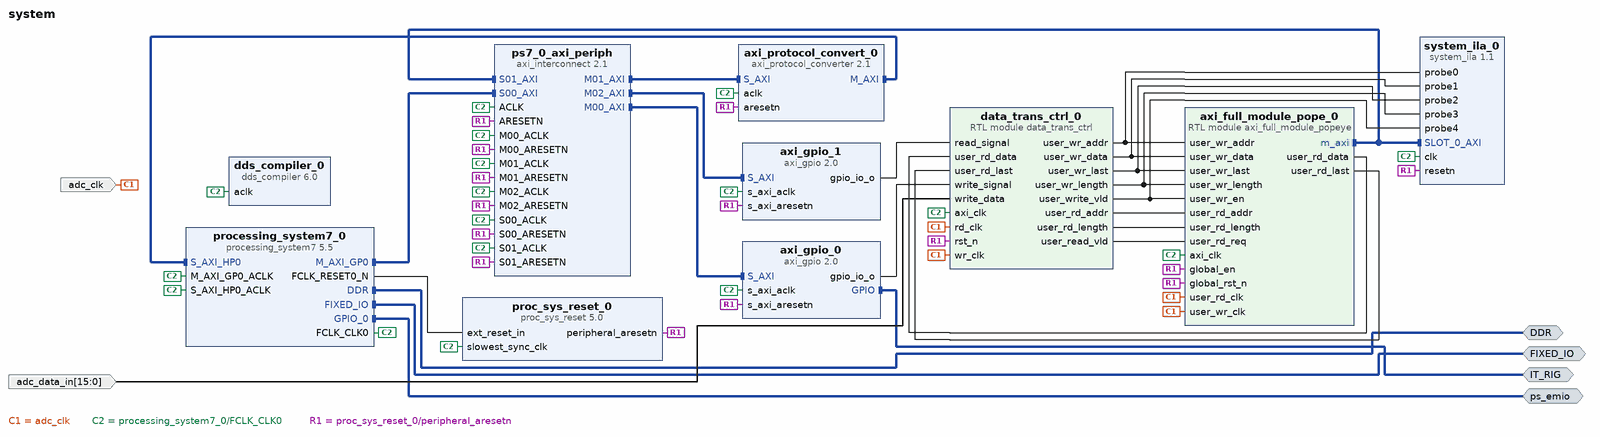
[diagram p0: block diagram of the top level]
# Vivado block design system, xc7z015clg485-2, Vivado 2023.1
create_bd_design system

create_bd_intf_port -mode Master -vlnv xilinx.com:interface:ddrx_rtl:1.0 DDR
create_bd_intf_port -mode Master -vlnv xilinx.com:display_processing_system7:fixedio_rtl:1.0 FIXED_IO
create_bd_intf_port -mode Master -vlnv xilinx.com:interface:gpio_rtl:1.0 ps_emio
create_bd_intf_port -mode Master -vlnv xilinx.com:interface:gpio_rtl:1.0 IT_RIG
create_bd_port -dir I -from 15 -to 0 adc_data_in
create_bd_port -dir I -type clk adc_clk
set_property -dict {CONFIG.FREQ_HZ 200000000} [get_bd_ports adc_clk]

create_bd_cell -type ip -vlnv xilinx.com:ip:processing_system7:5.5 processing_system7_0
set_property -dict [list \
  CONFIG.PCW_APU_PERIPHERAL_FREQMHZ 666.666666 \
  CONFIG.PCW_CPU_CPU_6X4X_MAX_RANGE 767 \
  CONFIG.PCW_ENET0_ENET0_IO {MIO 16 .. 27} \
  CONFIG.PCW_ENET0_GRP_MDIO_ENABLE 1 \
  CONFIG.PCW_ENET0_GRP_MDIO_IO {MIO 52 .. 53} \
  CONFIG.PCW_ENET0_PERIPHERAL_ENABLE 1 \
  CONFIG.PCW_ENET0_RESET_ENABLE 0 \
  CONFIG.PCW_ENET_RESET_ENABLE 1 \
  CONFIG.PCW_ENET_RESET_SELECT {Share reset pin} \
  CONFIG.PCW_FCLK_CLK0_BUF FALSE \
  CONFIG.PCW_FPGA0_PERIPHERAL_FREQMHZ 200 \
  CONFIG.PCW_FPGA1_PERIPHERAL_FREQMHZ 100 \
  CONFIG.PCW_GPIO_EMIO_GPIO_ENABLE 1 \
  CONFIG.PCW_GPIO_EMIO_GPIO_IO 4 \
  CONFIG.PCW_GPIO_EMIO_GPIO_WIDTH 4 \
  CONFIG.PCW_GPIO_MIO_GPIO_ENABLE 1 \
  CONFIG.PCW_GPIO_MIO_GPIO_IO MIO \
  CONFIG.PCW_I2C_RESET_ENABLE 0 \
  CONFIG.PCW_PERIPHERAL_BOARD_PRESET None \
  CONFIG.PCW_PRESET_BANK1_VOLTAGE {LVCMOS 1.8V} \
  CONFIG.PCW_QSPI_GRP_FBCLK_ENABLE 1 \
  CONFIG.PCW_QSPI_GRP_FBCLK_IO {MIO 8} \
  CONFIG.PCW_QSPI_GRP_SINGLE_SS_ENABLE 1 \
  CONFIG.PCW_QSPI_GRP_SINGLE_SS_IO {MIO 1 .. 6} \
  CONFIG.PCW_QSPI_PERIPHERAL_ENABLE 1 \
  CONFIG.PCW_QSPI_PERIPHERAL_FREQMHZ 125 \
  CONFIG.PCW_QSPI_QSPI_IO {MIO 1 .. 6} \
  CONFIG.PCW_SD0_GRP_CD_ENABLE 1 \
  CONFIG.PCW_SD0_GRP_CD_IO {MIO 47} \
  CONFIG.PCW_SD0_GRP_WP_ENABLE 0 \
  CONFIG.PCW_SD0_PERIPHERAL_ENABLE 1 \
  CONFIG.PCW_SD0_SD0_IO {MIO 40 .. 45} \
  CONFIG.PCW_SD1_GRP_CD_ENABLE 1 \
  CONFIG.PCW_SD1_GRP_CD_IO {MIO 9} \
  CONFIG.PCW_SD1_PERIPHERAL_ENABLE 1 \
  CONFIG.PCW_SD1_SD1_IO {MIO 10 .. 15} \
  CONFIG.PCW_SDIO_PERIPHERAL_FREQMHZ 50 \
  CONFIG.PCW_SINGLE_QSPI_DATA_MODE x4 \
  CONFIG.PCW_UART1_PERIPHERAL_ENABLE 1 \
  CONFIG.PCW_UART1_UART1_IO {MIO 28 .. 29} \
  CONFIG.PCW_UART_PERIPHERAL_FREQMHZ 100 \
  CONFIG.PCW_UIPARAM_DDR_FREQ_MHZ 533.333333 \
  CONFIG.PCW_UIPARAM_DDR_MEMORY_TYPE {DDR 3 (Low Voltage)} \
  CONFIG.PCW_UIPARAM_DDR_PARTNO {MT41K256M16 RE-125} \
  CONFIG.PCW_USB0_PERIPHERAL_ENABLE 0 \
  CONFIG.PCW_USB_RESET_ENABLE 0 \
  CONFIG.PCW_USE_S_AXI_HP0 1 \
  CONFIG.preset None \
] [get_bd_cells processing_system7_0]
# 501 more settings of processing_system7_0 are not shown: defaults, MIO pin electricals, DDR timing, and values the tool derives
create_bd_cell -type module -reference data_trans_ctrl data_trans_ctrl_0
set_property -dict [list \
  CONFIG.RD_BASEADDR 0x00000000 \
  CONFIG.SINGLE_RD_LENGTH 128 \
  CONFIG.SINGLE_WR_LENGTH 128 \
  CONFIG.TOTAL_RD_LENGTH 409600 \
  CONFIG.TOTAL_WR_LENGTH 409600 \
  CONFIG.WR_BASEADDR 0x00000000 \
] [get_bd_cells data_trans_ctrl_0]
create_bd_cell -type ip -vlnv xilinx.com:ip:axi_protocol_converter:2.1 axi_protocol_convert_0
set_property -dict [list \
  CONFIG.MI_PROTOCOL AXI3 \
  CONFIG.SI_PROTOCOL AXI4 \
  CONFIG.TRANSLATION_MODE 2 \
] [get_bd_cells axi_protocol_convert_0]
create_bd_cell -type ip -vlnv xilinx.com:ip:axi_gpio:2.0 axi_gpio_0
set_property -dict {CONFIG.C_ALL_OUTPUTS 1 CONFIG.C_GPIO_WIDTH 1} [get_bd_cells axi_gpio_0]
create_bd_cell -type ip -vlnv xilinx.com:ip:axi_interconnect:2.1 ps7_0_axi_periph
set_property -dict [list \
  CONFIG.M00_HAS_DATA_FIFO 0 \
  CONFIG.M00_HAS_REGSLICE 0 \
  CONFIG.M01_HAS_DATA_FIFO 0 \
  CONFIG.M01_HAS_REGSLICE 0 \
  CONFIG.NUM_MI 3 \
  CONFIG.NUM_SI 2 \
  CONFIG.S00_HAS_DATA_FIFO 2 \
  CONFIG.S00_HAS_REGSLICE 3 \
  CONFIG.S01_HAS_DATA_FIFO 2 \
  CONFIG.S01_HAS_REGSLICE 3 \
] [get_bd_cells ps7_0_axi_periph]
create_bd_cell -type module -reference axi_full_module_popeye axi_full_module_pope_0
set_property -dict {CONFIG.AXI_DATA_WIDTH 64} [get_bd_cells axi_full_module_pope_0]
create_bd_cell -type ip -vlnv xilinx.com:ip:dds_compiler:6.0 dds_compiler_0
set_property -dict [list \
  CONFIG.DDS_Clock_Rate 200 \
  CONFIG.Frequency_Resolution 0.4 \
  CONFIG.Has_Phase_Out false \
  CONFIG.M_DATA_Has_TUSER Not_Required \
  CONFIG.Noise_Shaping Auto \
  CONFIG.Output_Frequency1 10 \
  CONFIG.Output_Width 8 \
  CONFIG.PINC1 1100110011001100110011001 \
  CONFIG.Phase_Width 29 \
] [get_bd_cells dds_compiler_0]
create_bd_cell -type ip -vlnv xilinx.com:ip:axi_gpio:2.0 axi_gpio_1
set_property -dict {CONFIG.C_ALL_OUTPUTS 1 CONFIG.C_GPIO_WIDTH 1} [get_bd_cells axi_gpio_1]
create_bd_cell -type ip -vlnv xilinx.com:ip:proc_sys_reset:5.0 proc_sys_reset_0
create_bd_cell -type ip -vlnv xilinx.com:ip:system_ila:1.1 system_ila_0
set_property -dict [list \
  CONFIG.C_MON_TYPE MIX \
  CONFIG.C_NUM_MONITOR_SLOTS 1 \
  CONFIG.C_NUM_OF_PROBES 5 \
  CONFIG.C_PROBE0_TYPE 0 \
  CONFIG.C_PROBE1_TYPE 0 \
  CONFIG.C_PROBE2_TYPE 0 \
  CONFIG.C_PROBE3_TYPE 0 \
  CONFIG.C_PROBE4_TYPE 0 \
  CONFIG.C_SLOT_0_APC_EN 0 \
  CONFIG.C_SLOT_0_AXI_AR_SEL_DATA 1 \
  CONFIG.C_SLOT_0_AXI_AR_SEL_TRIG 1 \
  CONFIG.C_SLOT_0_AXI_AW_SEL_DATA 1 \
  CONFIG.C_SLOT_0_AXI_AW_SEL_TRIG 1 \
  CONFIG.C_SLOT_0_AXI_B_SEL_DATA 1 \
  CONFIG.C_SLOT_0_AXI_B_SEL_TRIG 1 \
  CONFIG.C_SLOT_0_AXI_R_SEL_DATA 1 \
  CONFIG.C_SLOT_0_AXI_R_SEL_TRIG 1 \
  CONFIG.C_SLOT_0_AXI_W_SEL_DATA 1 \
  CONFIG.C_SLOT_0_AXI_W_SEL_TRIG 1 \
  CONFIG.C_SLOT_0_INTF_TYPE xilinx.com:interface:aximm_rtl:1.0 \
] [get_bd_cells system_ila_0]

# ---- connections ----

connect_bd_intf_net -intf_net axi_full_module_pope_0_m_axi [get_bd_intf_pins axi_full_module_pope_0/m_axi] [get_bd_intf_pins ps7_0_axi_periph/S01_AXI]
connect_bd_intf_net [get_bd_intf_pins axi_full_module_pope_0/m_axi] [get_bd_intf_pins system_ila_0/SLOT_0_AXI]
connect_bd_intf_net [get_bd_intf_ports IT_RIG] [get_bd_intf_pins axi_gpio_0/GPIO]
connect_bd_intf_net [get_bd_intf_pins axi_protocol_convert_0/M_AXI] [get_bd_intf_pins processing_system7_0/S_AXI_HP0]
connect_bd_intf_net [get_bd_intf_ports DDR] [get_bd_intf_pins processing_system7_0/DDR]
connect_bd_intf_net [get_bd_intf_ports FIXED_IO] [get_bd_intf_pins processing_system7_0/FIXED_IO]
connect_bd_intf_net [get_bd_intf_ports ps_emio] [get_bd_intf_pins processing_system7_0/GPIO_0]
connect_bd_intf_net [get_bd_intf_pins processing_system7_0/M_AXI_GP0] [get_bd_intf_pins ps7_0_axi_periph/S00_AXI]
connect_bd_intf_net [get_bd_intf_pins ps7_0_axi_periph/M00_AXI] [get_bd_intf_pins axi_gpio_0/S_AXI]
connect_bd_intf_net [get_bd_intf_pins ps7_0_axi_periph/M01_AXI] [get_bd_intf_pins axi_protocol_convert_0/S_AXI]
connect_bd_intf_net [get_bd_intf_pins axi_gpio_1/S_AXI] [get_bd_intf_pins ps7_0_axi_periph/M02_AXI]
connect_bd_net [get_bd_ports adc_clk] \
  [get_bd_pins axi_full_module_pope_0/user_wr_clk] [get_bd_pins axi_full_module_pope_0/user_rd_clk] \
  [get_bd_pins data_trans_ctrl_0/rd_clk] [get_bd_pins data_trans_ctrl_0/wr_clk]
connect_bd_net [get_bd_pins processing_system7_0/FCLK_CLK0] \
  [get_bd_pins axi_protocol_convert_0/aclk] [get_bd_pins axi_gpio_1/s_axi_aclk] \
  [get_bd_pins processing_system7_0/M_AXI_GP0_ACLK] [get_bd_pins processing_system7_0/S_AXI_HP0_ACLK] \
  [get_bd_pins proc_sys_reset_0/slowest_sync_clk] [get_bd_pins axi_gpio_0/s_axi_aclk] [get_bd_pins ps7_0_axi_periph/ACLK] \
  [get_bd_pins ps7_0_axi_periph/S00_ACLK] [get_bd_pins ps7_0_axi_periph/M00_ACLK] [get_bd_pins ps7_0_axi_periph/S01_ACLK] \
  [get_bd_pins ps7_0_axi_periph/M01_ACLK] [get_bd_pins ps7_0_axi_periph/M02_ACLK] \
  [get_bd_pins axi_full_module_pope_0/axi_clk] [get_bd_pins data_trans_ctrl_0/axi_clk] [get_bd_pins dds_compiler_0/aclk] \
  [get_bd_pins system_ila_0/clk]
connect_bd_net [get_bd_ports adc_data_in] [get_bd_pins data_trans_ctrl_0/write_data]
connect_bd_net [get_bd_pins axi_full_module_pope_0/user_rd_data] [get_bd_pins data_trans_ctrl_0/user_rd_data]
connect_bd_net [get_bd_pins axi_full_module_pope_0/user_rd_last] [get_bd_pins data_trans_ctrl_0/user_rd_last]
connect_bd_net [get_bd_pins axi_gpio_0/gpio_io_o] [get_bd_pins data_trans_ctrl_0/write_signal]
connect_bd_net [get_bd_pins axi_gpio_1/gpio_io_o] [get_bd_pins data_trans_ctrl_0/read_signal]
connect_bd_net [get_bd_pins data_trans_ctrl_0/user_rd_addr] [get_bd_pins axi_full_module_pope_0/user_rd_addr]
connect_bd_net [get_bd_pins data_trans_ctrl_0/user_rd_length] [get_bd_pins axi_full_module_pope_0/user_rd_length]
connect_bd_net [get_bd_pins data_trans_ctrl_0/user_read_vld] [get_bd_pins axi_full_module_pope_0/user_rd_req]
connect_bd_net -net data_trans_ctrl_0_user_wr_addr [get_bd_pins data_trans_ctrl_0/user_wr_addr] \
  [get_bd_pins axi_full_module_pope_0/user_wr_addr] [get_bd_pins system_ila_0/probe0]
connect_bd_net -net data_trans_ctrl_0_user_wr_data [get_bd_pins data_trans_ctrl_0/user_wr_data] \
  [get_bd_pins axi_full_module_pope_0/user_wr_data] [get_bd_pins system_ila_0/probe1]
connect_bd_net -net data_trans_ctrl_0_user_wr_last [get_bd_pins data_trans_ctrl_0/user_wr_last] \
  [get_bd_pins axi_full_module_pope_0/user_wr_last] [get_bd_pins system_ila_0/probe2]
connect_bd_net -net data_trans_ctrl_0_user_wr_length [get_bd_pins data_trans_ctrl_0/user_wr_length] \
  [get_bd_pins axi_full_module_pope_0/user_wr_length] [get_bd_pins system_ila_0/probe3]
connect_bd_net -net data_trans_ctrl_0_user_write_vld [get_bd_pins data_trans_ctrl_0/user_write_vld] \
  [get_bd_pins axi_full_module_pope_0/user_wr_en] [get_bd_pins system_ila_0/probe4]
connect_bd_net [get_bd_pins proc_sys_reset_0/peripheral_aresetn] \
  [get_bd_pins axi_gpio_0/s_axi_aresetn] [get_bd_pins axi_protocol_convert_0/aresetn] [get_bd_pins axi_gpio_1/s_axi_aresetn] \
  [get_bd_pins ps7_0_axi_periph/M02_ARESETN] [get_bd_pins ps7_0_axi_periph/M01_ARESETN] \
  [get_bd_pins ps7_0_axi_periph/S01_ARESETN] [get_bd_pins ps7_0_axi_periph/M00_ARESETN] \
  [get_bd_pins ps7_0_axi_periph/S00_ARESETN] [get_bd_pins ps7_0_axi_periph/ARESETN] [get_bd_pins system_ila_0/resetn] \
  [get_bd_pins axi_full_module_pope_0/global_rst_n] [get_bd_pins axi_full_module_pope_0/global_en] \
  [get_bd_pins data_trans_ctrl_0/rst_n]
connect_bd_net [get_bd_pins processing_system7_0/FCLK_RESET0_N] [get_bd_pins proc_sys_reset_0/ext_reset_in]
set_property HDL_ATTRIBUTE.DEBUG true [get_bd_intf_nets axi_full_module_pope_0_m_axi]
set_property HDL_ATTRIBUTE.MARK_DEBUG true [get_bd_intf_nets axi_full_module_pope_0_m_axi]
set_property HDL_ATTRIBUTE.DEBUG true [get_bd_nets data_trans_ctrl_0_user_wr_addr]
set_property HDL_ATTRIBUTE.MARK_DEBUG true [get_bd_nets data_trans_ctrl_0_user_wr_addr]
set_property HDL_ATTRIBUTE.DEBUG true [get_bd_nets data_trans_ctrl_0_user_wr_data]
set_property HDL_ATTRIBUTE.MARK_DEBUG true [get_bd_nets data_trans_ctrl_0_user_wr_data]
set_property HDL_ATTRIBUTE.DEBUG true [get_bd_nets data_trans_ctrl_0_user_wr_last]
set_property HDL_ATTRIBUTE.MARK_DEBUG true [get_bd_nets data_trans_ctrl_0_user_wr_last]
set_property HDL_ATTRIBUTE.DEBUG true [get_bd_nets data_trans_ctrl_0_user_wr_length]
set_property HDL_ATTRIBUTE.MARK_DEBUG true [get_bd_nets data_trans_ctrl_0_user_wr_length]
set_property HDL_ATTRIBUTE.DEBUG true [get_bd_nets data_trans_ctrl_0_user_write_vld]
set_property HDL_ATTRIBUTE.MARK_DEBUG true [get_bd_nets data_trans_ctrl_0_user_write_vld]

# ---- address map ----
assign_bd_address -offset 0x00000000 -range 1G -target_address_space [get_bd_addr_spaces axi_full_module_pope_0/m_axi] [get_bd_addr_segs processing_system7_0/S_AXI_HP0/HP0_DDR_LOWOCM]
assign_bd_address -offset 0x41200000 -range 64K -target_address_space [get_bd_addr_spaces axi_full_module_pope_0/m_axi] [get_bd_addr_segs axi_gpio_0/S_AXI/Reg]
assign_bd_address -offset 0x41210000 -range 64K -target_address_space [get_bd_addr_spaces axi_full_module_pope_0/m_axi] [get_bd_addr_segs axi_gpio_1/S_AXI/Reg]
assign_bd_address -offset 0x41200000 -range 64K -target_address_space [get_bd_addr_spaces processing_system7_0/Data] [get_bd_addr_segs axi_gpio_0/S_AXI/Reg]
assign_bd_address -offset 0x41210000 -range 64K -target_address_space [get_bd_addr_spaces processing_system7_0/Data] [get_bd_addr_segs axi_gpio_1/S_AXI/Reg]
exclude_bd_addr_seg -offset 0x00000000 -range 1 -target_address_space [get_bd_addr_spaces processing_system7_0/Data] [get_bd_addr_segs processing_system7_0/S_AXI_HP0/HP0_DDR_LOWOCM]

validate_bd_design
save_bd_design
